# EAGLE design teensy_toslink_v1.0 (EAGLE 9.6.2)
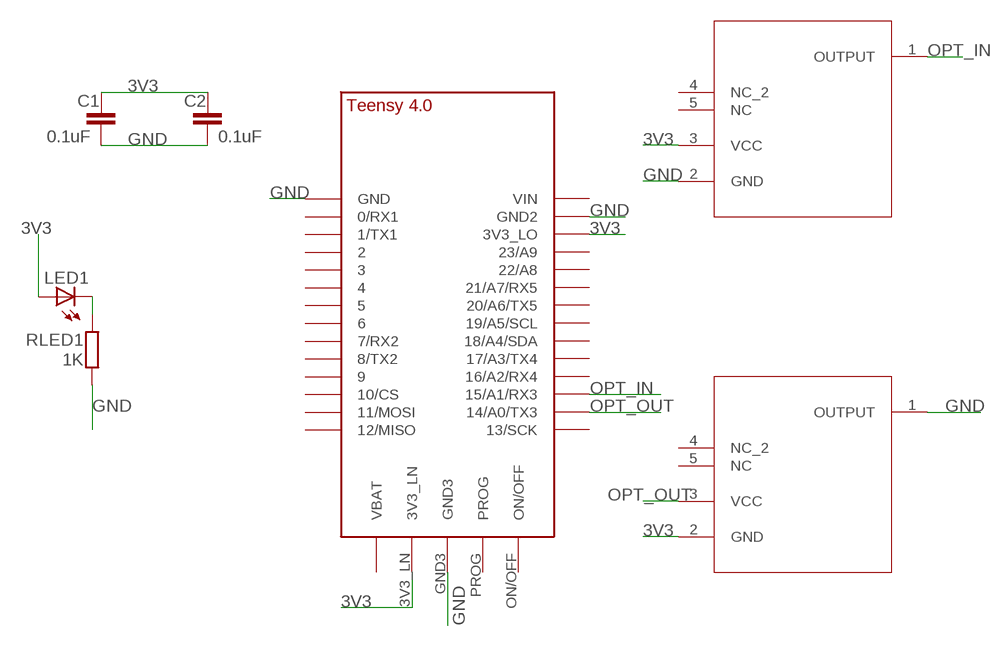
[diagram p0: schematic, sheet 1]

## Parts
C1  0.1uF  C-EUC0805  [C0805]
C2  0.1uF  C-EUC0805  [C0805]
J1  TORX141P(F)TORX141P(F)_TOS  [TORX141P(F)_TOS]
J2  TORX141P(F)TORX141P(F)_TOS  [TORX141P(F)_TOS]
LED1  0805  LEDCHIPLED_0805  [CHIPLED_0805]
RLED1  1K  R-EU_R0805  [R0805]
U$1  TEENSY_4.0  [TEENSY_4.0]

## Nets
3V3 [power]: C1.1 C2.1 J1.3(VCC) J2.2(GND) LED1.A U$1.3V3_LN U$1.3V3_LO
GND [power]: C1.2 C2.2 J1.2(GND) J2.1(OUTPUT) RLED1.1 U$1.GND U$1.GND2 U$1.GND3
N$8: LED1.C RLED1.2
OPT_IN: J1.1(OUTPUT) U$1.15/A1(15/A1/RX3)
OPT_OUT: J2.3(VCC) U$1.14/A0(14/A0/TX3)
Unconnected: J1.4(NC_2) J1.5(NC) J2.4(NC_2) J2.5(NC) U$1.0/RX(0/RX1) U$1.1/TX(1/TX1) U$1.2 U$1.3/CANTX U$1.4/CANRX U$1.5 U$1.6 U$1.7(7/RX2) U$1.8(8/TX2) U$1.9/CS U$1.10/CS U$1.11/MOSI U$1.12/MISO U$1.13/SCK U$1.16/A2(16/A2/RX4) U$1.17/A3(17/A3/TX4) U$1.18/A4/SDA U$1.19/A5/SCL U$1.20/A6(20/A6/TX5) U$1.21/A7(21/A7/RX5) U$1.22/A8 U$1.23/A9 U$1.ON/OFF U$1.PROG U$1.VBAT\(VBAT) U$1.VIN

## Library data of the parts
C1 C2 = resistor:C-EU: CAPACITOR, European symbol
J1 J2 = toslink:TORX141P(F); COPYRIGHT: Copyright (C) 2023 Ultra Librarian. All rights reserved.; MANUFACTURER_PART_NUMBER: TORX141P(F); MFR_NAME: Toshiba Electronic Devices & Storage Corp.
LED1 = led:LED: LED OSRAM: - CHIPLED LG R971, LG N971, LY N971, LG Q971, LY Q971, LO R971, LY R971 LH N974, LH R974 LS Q976, LO Q976, LY Q976 LO Q996 - Hyper CHIPLED LW Q18S LB Q993, LB Q99A, LB R99A - SideLED LS A670, LO A670, LY A670, LG A670, LP A670 LB A673, LV A673, LT A673, LW A673 LH A674 LY A675 LS A676, LA A676, LO A676, LY A676, LW A676 LS A679, LY A679, LG A679 - Hyper Micro SIDELED® LS Y876, LA Y876, LO Y876, LY Y876 LT Y87S - SmartLED LW L88C, LW L88S LB L89C, LB L89S, LG L890 LS L89K, LO L89K, LY L89K LS L896, LA L896, LO L896, LY L896 - TOPLED LS T670, LO T670, LY T670, LG T670, LP T670 LSG T670, LSP T670, LSY T670, LOP T670, LYG T670 LG T671, LOG T671, LSG T671 LB T673, LV T673, LT T673, LW T673 LH T674 LS T676, LA T676, LO T676, LY T676, LB T676, LH T676, LSB T676, LW T676 LB T67C, LV T67C, LT T67C, LS T67K, LO T67K, LY T67K, LW E67C LS E67B, LA E67B, LO E67B, LY E67B, LB E67C, LV E67C, LT E67C LW T67C LS T679, LY T679, LG T679 LS T770, LO T770, LY T770, LG T770, LP T770 LB T773, LV T773, LT T773, LW T773 LH T774 LS E675, LA E675, LY E675, LS T675 LS T776, LA T776, LO T776, LY T776, LB T776 LHGB T686 LT T68C, LB T68C - Hyper Mini TOPLED® LB M676 - Mini TOPLED Santana® LG M470 LS M47K, LO M47K, LY M47K Source: http://www.osram.convergy.de LUXEON: - LUMILED® LXK2-PW12-R00, LXK2-PW12-S00, LXK2-PW14-U00, LXK2-PW14-V00 LXK2-PM12-R00, LXK2-PM12-S00, LXK2-PM14-U00 LXK2-PE12-Q00, LXK2-PE12-R00, LXK2-PE12-S00, LXK2-PE14-T00, LXK2-PE14-U00 LXK2-PB12-K00, LXK2-PB12-L00, LXK2-PB12-M00, LXK2-PB14-N00, LXK2-PB14-P00, LXK2-PB14-Q00 LXK2-PR12-L00, LXK2-PR12-M00, LXK2-PR14-Q00, LXK2-PR14-R00 LXK2-PD12-Q00, LXK2-PD12-R00, LXK2-PD12-S00 LXK2-PH12-R00, LXK2-PH12-S00 LXK2-PL12-P00, LXK2-PL12-Q00, LXK2-PL12-R00 Source: www.luxeon.com KINGBRIGHT: KA-3528ASYC Source: www.kingbright.com
RLED1 = rcl:R-EU_: RESISTOR, European symbol
U$1 = TEENSY 4.0:TEENSY_4.0

## Net classes
0 default: width 0.406 mm, clearance 0.203 mm
1 power: width 0.508 mm, clearance 0.203 mm

## Board
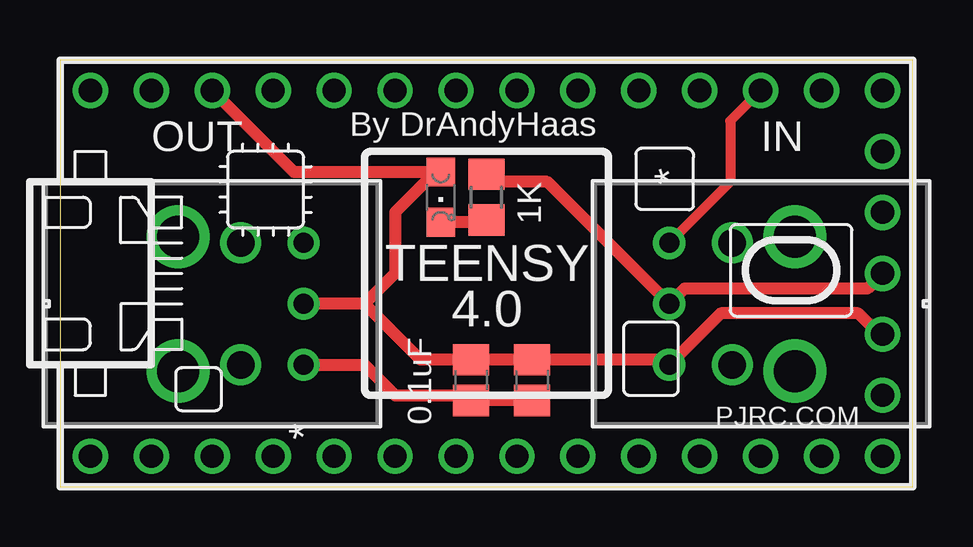
[diagram p1: board, top side]
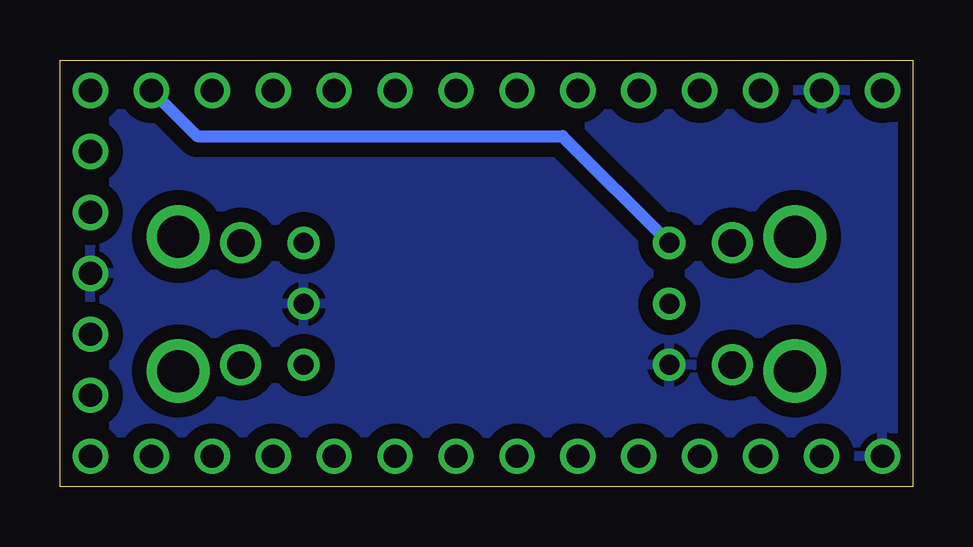
[diagram p2: board, bottom side, seen from below]

Size 35.56 x 17.78 mm. Coordinates in mm from the lower left corner, seen from the top.
Outline: 0,17.78 0,0 35.56,0 35.56,17.78 0,17.78
Copper layers (1*16): Top 0.035mm / dielectric 1.5mm / Bottom 0.035mm
Design rules "Fusion_eagle_rule_v1.1": minimum track width 6mil, minimum drill 12mil, track to track 6mil, track to pad 6mil, pad to pad 6mil, via to via 6mil, smd to smd 0mil, copper to edge 10mil, drill to drill 10mil, minimum pad ring 10mil, minimum via ring 6mil, stop-mask expansion 2mil, vias tented up to drill 100mil, thermal gap 10mil
vRestrict: area 29.2,15.2 to 34.3,19.1

### Footprints (pad centres in the part's own frame; a part is rotated, then mirrored left to right if it is on the bottom)
C0805 = smd 1.3 x 1.5: 1 -0.85,0; 2 0.85,0
TORX141P(F)_TOS = drill 0.838 pad 1.346: 1 0,0; 2 2.54,0; 3 5.08,0 | drill 1.143 pad 1.651: 4 0,2.625; 5 5.08,2.625 | drill 1.753 pad 1.753: 6 -0.26,5.235; 7 5.34,5.235
CHIPLED_0805 = smd 1.2 x 1.2: A 0,-1.05; C 0,1.05
R0805 = smd 1.3 x 1.5: 1 -0.95,0; 2 0.95,0
TEENSY_4.0 = drill 0.965: 0/RX -13.97,-7.62; 1/TX -11.43,-7.62; 2 -8.89,-7.62; 3/CANTX -6.35,-7.62; 3V3_LN 16.51,-2.54; 3V3_LO -11.43,7.62; 4/CANRX -3.81,-7.62; 5 -1.27,-7.62; 6 1.27,-7.62; 7 3.81,-7.62; 8 6.35,-7.62; 9/CS 8.89,-7.62; 10/CS 11.43,-7.62; 11/MOSI 13.97,-7.62; 12/MISO 16.51,-7.62; 13/SCK 16.51,7.62; 14/A0 13.97,7.62; 15/A1 11.43,7.62; 16/A2 8.89,7.62; 17/A3 6.35,7.62; 18/A4/SDA 3.81,7.62; 19/A5/SCL 1.27,7.62; 20/A6 -1.27,7.62; 21/A7 -3.81,7.62; 22/A8 -6.35,7.62; 23/A9 -8.89,7.62; GND -16.51,-7.62; GND2 -13.97,7.62; GND3 16.51,0; ON/OFF 16.51,5.08; PROG 16.51,2.54; VBAT\ 16.51,-5.08; VIN -16.51,7.62

### Placement (x,y rotation side)
C1  17.14,4.45 270 top
C2  19.68,4.45 270 top
J1  25.4,10.16 270 top
J2  10.16,5.08 90 top
LED1  15.88,12.06 180 top
RLED1  17.78,12.06 270 top
U$1  17.78,8.89 0 top

### Tracks (layer width: path | path; a pad name or v marks a point on that pad's centre or on a via)
3V3
  Top 0.508: U$1.3V3_LN 34.15,6.35 33.27,7.23 27.55,7.23 J1.3 25.18,5.29 C2.1 C1.1 15.03,5.29 12.7,7.62 | 12.7,7.62 13.97,8.89 13.97,11.43 15.65,13.12 LED1.A 9.74,13.12 U$1.3V3_LO | 12.7,7.62 J2.2
GND
  Top 0.508: U$1.GND3 33.66,8.26 26.04,8.26 J1.2 20.32,12.7 18.09,12.7 RLED1.1 | J2.1 12.7,5.08 13.97,3.81 16.93,3.81 C1.2 C2.2
  pour Bottom (isolate 0.61): -1.27,19.05 36.83,19.05 36.83,-1.27 -1.27,-1.27
N$8
  Top 0.508: RLED1.2 17.68,11.02 LED1.C
OPT_IN
  Top 0.406: J1.1 27.94,12.7 27.94,15.24 U$1.15/A1
OPT_OUT
  Bottom 0.508: J2.3 14.61,14.61 29.84,14.61 U$1.14/A0

### Text on the board
tPlace: By DrAndyHaas | OUT | IN